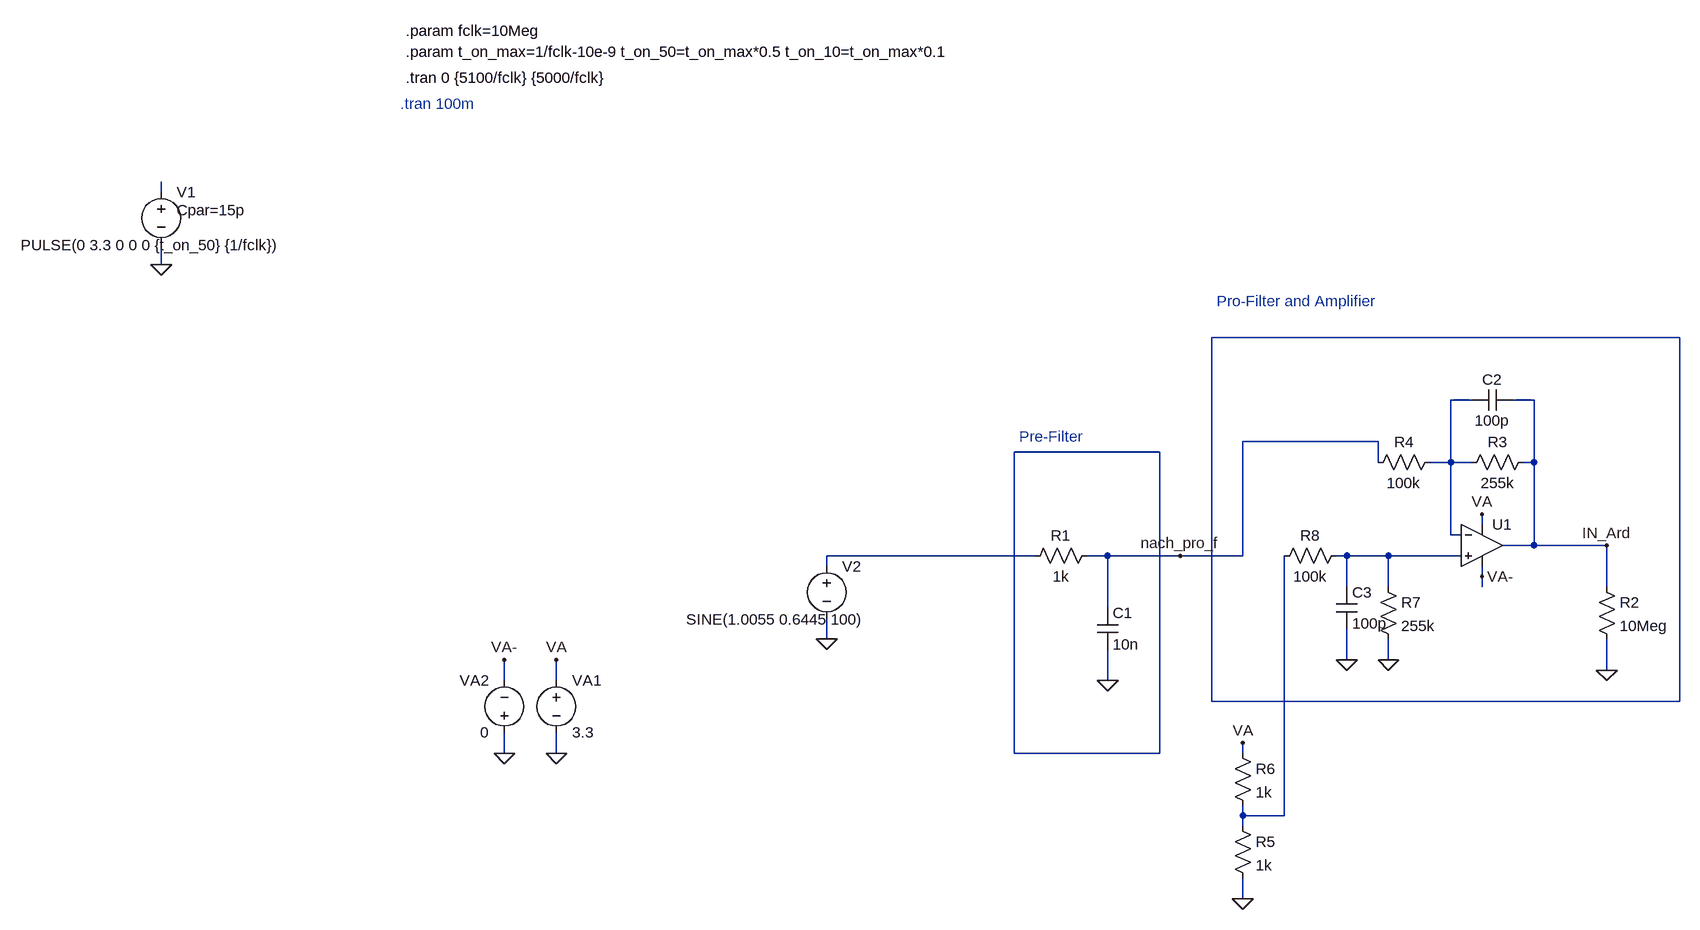
[diagram p0: schematic ejemploarchivo.asc]
ejemploarchivo.asc, the LTspice schematic file:
Version 4
SHEET 1 1044 756
WIRE -1296 -352 -1296 -368
WIRE -1296 -240 -1296 -272
WIRE 1040 -128 320 -128
WIRE 720 -32 688 -32
WIRE 816 -32 784 -32
WIRE 576 32 368 32
WIRE 240 48 16 48
WIRE 576 64 576 32
WIRE 688 64 688 -32
WIRE 688 64 656 64
WIRE 720 64 688 64
WIRE 816 64 816 -32
WIRE 816 64 800 64
WIRE 736 160 736 144
WIRE 688 176 688 64
WIRE 704 176 688 176
WIRE 816 192 816 64
WIRE 816 192 768 192
WIRE 928 192 816 192
WIRE 48 208 -272 208
WIRE 160 208 128 208
WIRE 272 208 160 208
WIRE 368 208 368 32
WIRE 368 208 272 208
WIRE 528 208 512 208
WIRE 592 208 528 208
WIRE 704 208 592 208
WIRE -272 224 -272 208
WIRE 736 240 736 224
WIRE 528 256 528 208
WIRE 592 256 592 208
WIRE 736 256 736 240
WIRE 928 256 928 192
WIRE 160 288 160 208
WIRE -272 336 -272 304
WIRE 528 368 528 320
WIRE 592 368 592 336
WIRE 928 384 928 336
WIRE -768 400 -768 368
WIRE -688 400 -688 368
WIRE 160 400 160 352
WIRE 320 432 320 -128
WIRE 1040 432 1040 -128
WIRE 1040 432 320 432
WIRE -768 512 -768 480
WIRE -688 512 -688 480
WIRE 16 512 16 48
WIRE 240 512 240 48
WIRE 240 512 16 512
WIRE 368 512 368 496
WIRE 368 608 368 592
WIRE 432 608 432 208
WIRE 432 608 368 608
WIRE 368 624 368 608
WIRE 368 736 368 704
FLAG 160 400 0
FLAG 928 384 0
FLAG 736 144 VA
FLAG 736 240 VA-
FLAG 368 736 0
FLAG 928 192 IN_Ard
FLAG -1296 -240 0
FLAG -688 512 0
FLAG -688 368 VA
FLAG -768 512 0
FLAG -768 368 VA-
FLAG 368 496 VA
FLAG 272 208 nach_pro_f
FLAG 592 368 0
FLAG 528 368 0
FLAG -272 336 0
SYMBOL res 144 192 R90
WINDOW 0 0 56 VBottom 2
WINDOW 3 32 56 VTop 2
SYMATTR InstName R1
SYMATTR Value 1k
SYMBOL cap 144 288 R0
SYMATTR InstName C1
SYMATTR Value 10n
SYMBOL res 912 240 R0
SYMATTR InstName R2
SYMATTR Value 10Meg
SYMBOL res 816 48 R90
WINDOW 0 0 56 VBottom 2
WINDOW 3 32 56 VTop 2
SYMATTR InstName R3
SYMATTR Value 255k
SYMBOL res 672 48 R90
WINDOW 0 0 56 VBottom 2
WINDOW 3 32 56 VTop 2
SYMATTR InstName R4
SYMATTR Value 100k
SYMBOL cap 784 -48 R90
WINDOW 0 0 32 VBottom 2
WINDOW 3 32 32 VTop 2
SYMATTR InstName C2
SYMATTR Value 100p
SYMBOL voltage -1296 -368 R0
WINDOW 3 -216 98 Left 2
WINDOW 123 0 0 Left 0
WINDOW 39 24 44 Left 2
SYMATTR Value PULSE(0 3.3 0 0 0 {t_on_50} {1/fclk})
SYMATTR SpiceLine Cpar=15p
SYMATTR InstName V1
SYMBOL voltage -688 384 R0
WINDOW 123 0 0 Left 0
WINDOW 39 0 0 Left 0
SYMATTR InstName VA1
SYMATTR Value 3.3
SYMBOL voltage -768 496 R180
WINDOW 0 24 96 Left 2
WINDOW 3 24 16 Left 2
WINDOW 123 0 0 Left 0
WINDOW 39 0 0 Left 0
SYMATTR InstName VA2
SYMATTR Value 0
SYMBOL res 352 608 R0
SYMATTR InstName R5
SYMATTR Value 1k
SYMBOL res 352 496 R0
SYMATTR InstName R6
SYMATTR Value 1k
SYMBOL res 576 240 R0
SYMATTR InstName R7
SYMATTR Value 255k
SYMBOL cap 512 256 R0
SYMATTR InstName C3
SYMATTR Value 100p
SYMBOL res 528 192 R90
WINDOW 0 0 56 VBottom 2
WINDOW 3 32 56 VTop 2
SYMATTR InstName R8
SYMATTR Value 100k
SYMBOL OpAmps\\UniversalOpAmp2 736 192 R0
SYMATTR InstName U1
SYMBOL voltage -272 208 R0
WINDOW 3 -216 98 Left 2
WINDOW 123 0 0 Left 0
WINDOW 39 0 0 Left 0
SYMATTR Value SINE(1.0055 0.6445 100)
SYMATTR InstName V2
TEXT 24 24 Left 2 ;Pre-Filter
TEXT 328 -184 Left 2 ;Pro-Filter and Amplifier
TEXT -920 -528 Left 2 !.tran 0 {5100/fclk} {5000/fclk}
TEXT -920 -568 Left 2 !.param t_on_max=1/fclk-10e-9 t_on_50=t_on_max*0.5 t_on_10=t_on_max*0.1
TEXT -920 -600 Left 2 !.param fclk=10Meg
TEXT -928 -488 Left 2 ;.tran 100m

The netlist it stands for:
* ejemploarchivo.asc
R1 nach_pro_f N005 1k
C1 nach_pro_f 0 10n
R2 IN_Ard 0 10Meg
R3 IN_Ard N003 255k
R4 N003 nach_pro_f 100k
C2 IN_Ard N003 100p
V1 N001 0 PULSE(0 3.3 0 0 0 {t_on_50} {1/fclk}) Cpar=15p
VA1 VA 0 3.3
VA2 0 VA- 0
R5 N007 0 1k
R6 VA N007 1k
R7 N006 0 255k
C3 N006 0 100p
R8 N006 N007 100k
XU1 N006 N003 VA VA- IN_Ard level2 Avol=1Meg GBW=10Meg Slew=10Meg Ilimit=25m Rail=0 Vos=0 En=0 Enk=0 In=0 Ink=0 Rin=500Meg  ; pins In+ In- V+ V- OUT
V2 N005 0 SINE(1.0055 0.6445 100)
* Pre-Filter
* Pro-Filter and Amplifier
.tran 0 {5100/fclk} {5000/fclk}
.param t_on_max=1/fclk-10e-9 t_on_50=t_on_max*0.5 t_on_10=t_on_max*0.1
.param fclk=10Meg
* .tran 100m
.lib UniversalOpAmp2.lib
.backanno
.end